# Altium schematic sheet Car_bord.SchDoc
size A3
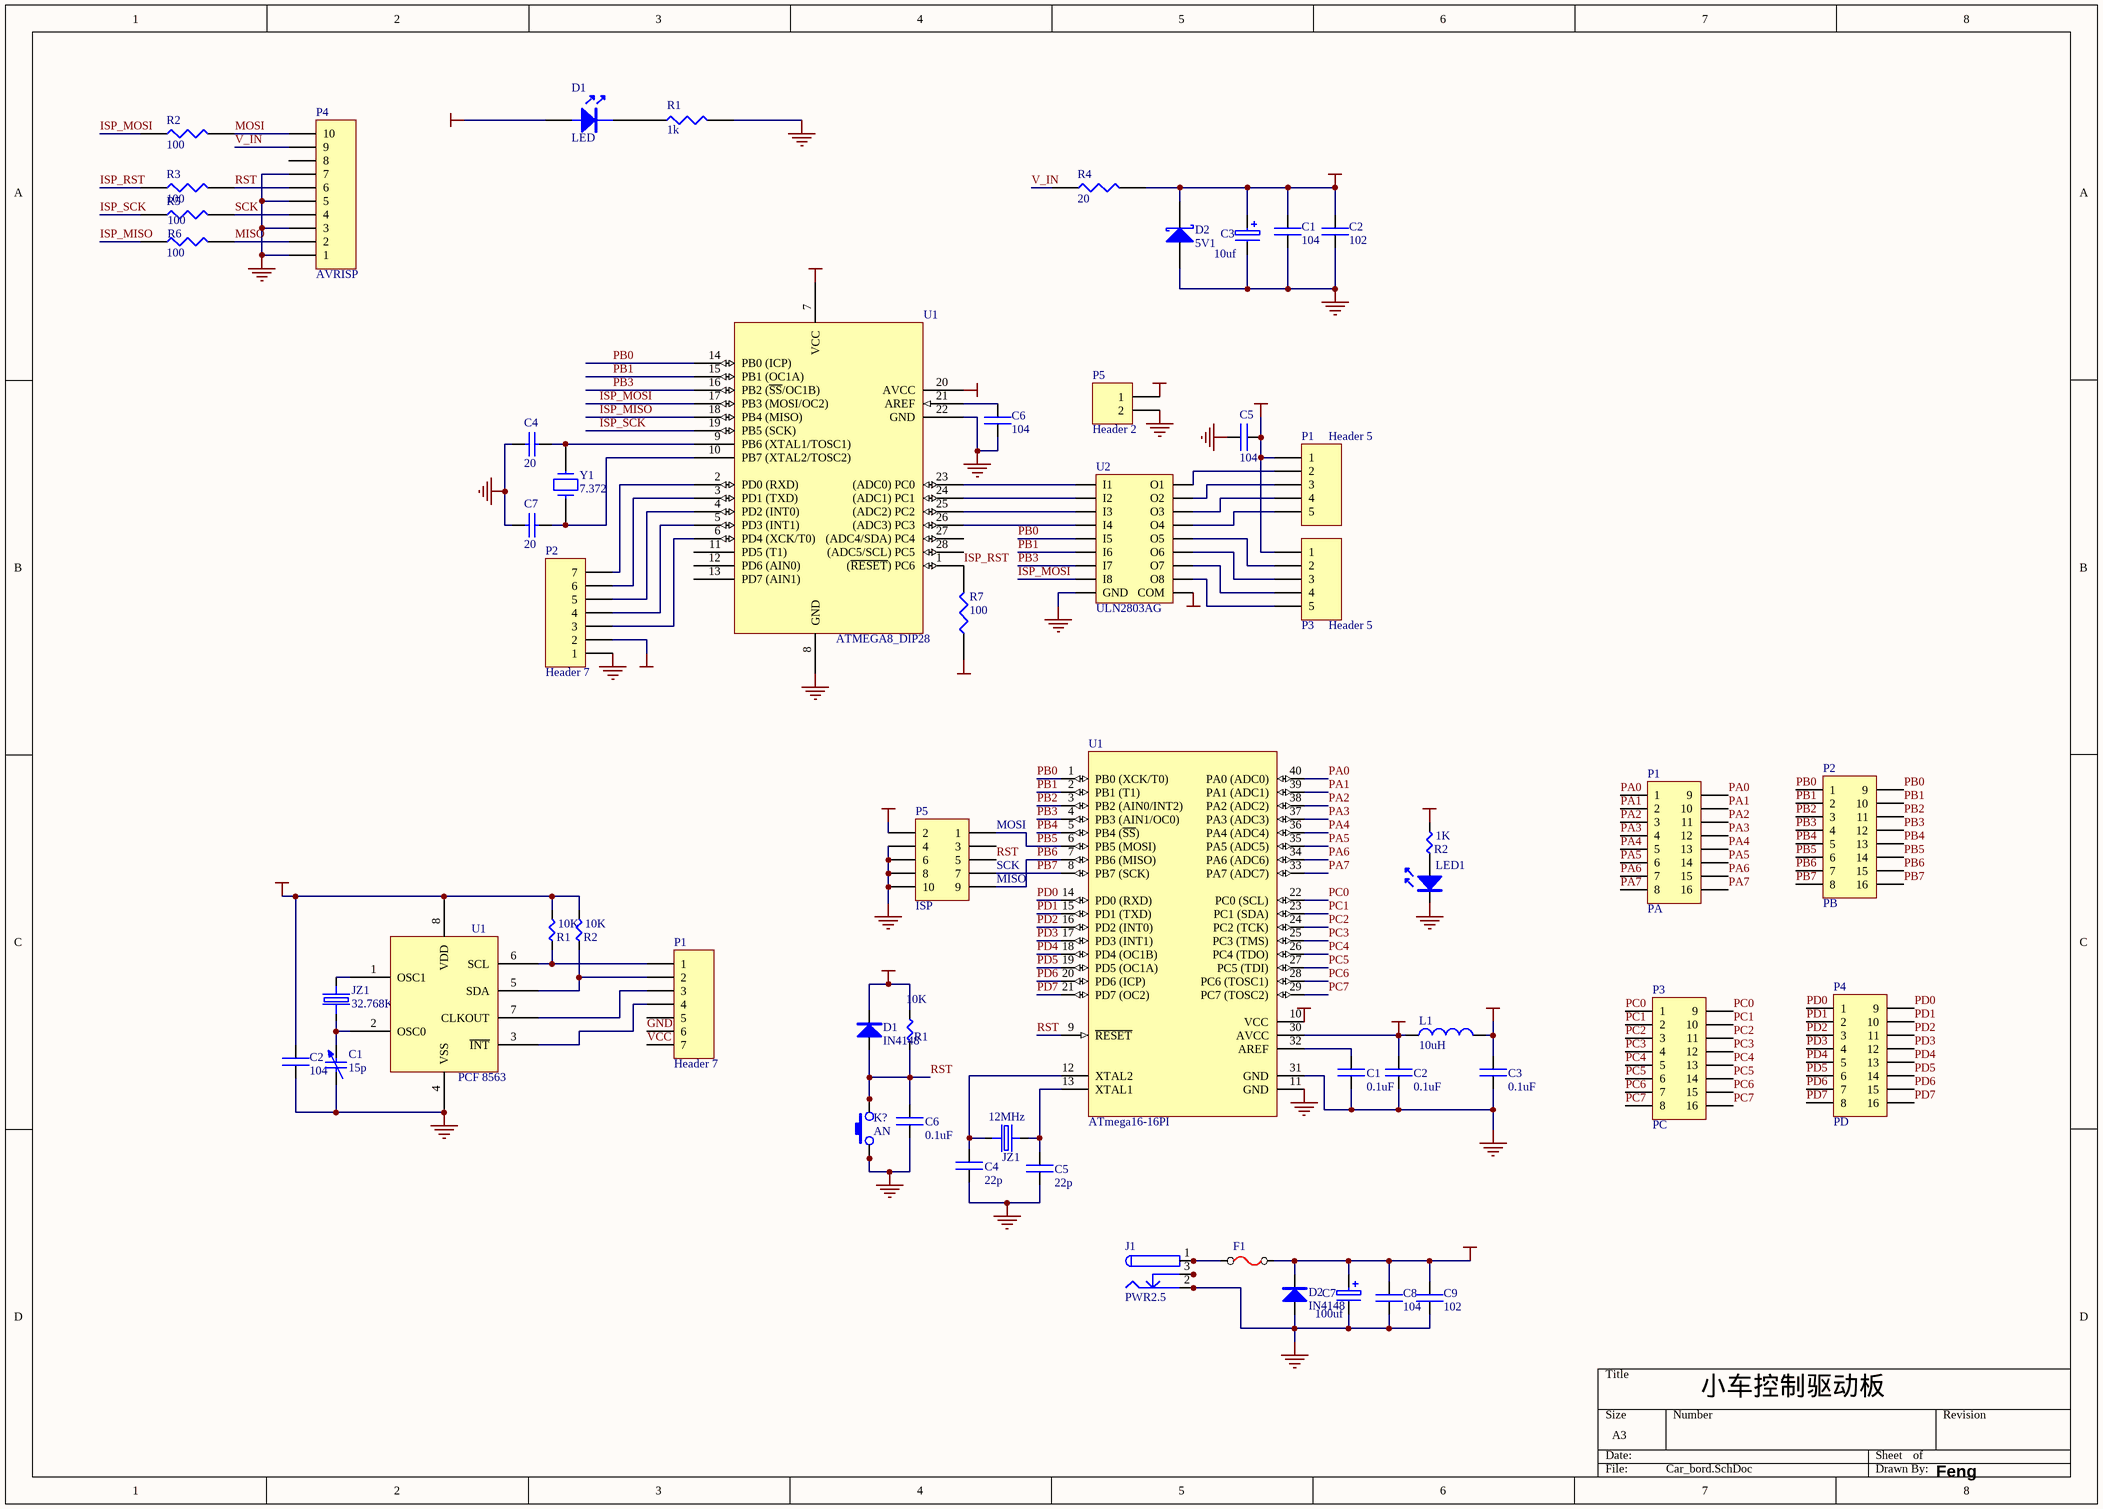
[diagram p0: Car_bord.SchDoc]

## Parts
(Parts that share a designator on the sheet are numbered #1, #2 ... from top to bottom, then left to right.)
C1#1  104  [CB1]
C1#2  0.1uF  [CAP_104]
C1#3  15p  [BCY-W2/D3.1]
C2#1  102  [CB1]
C2#2  104  [CAP_104]
C2#3  0.1uF  [CAP_104]
C3#1  10uf  [10U16]
C3#2  0.1uF  [CAP_104]
C4#1  20  [CB1]
C4#2  22p  [CB1]
C5#1  104  [CB1]
C5#2  22p  [CB1]
C6#1  104  [CB1]
C6#2  0.1uF  [CAP_104]
C7#1  20  [CB1]
C7#2  100uf  [10U16]
C8  104  [CAP_104]
C9  102  [CAP_104]
D1#1  LED  [LED_5]
D1#2  IN4148  [DIODE]
D2#1  5V1  [DIODE]
D2#2  IN4148  [DIODE]
F1  FUSE  [CAP_104]  (value not drawn)
J1  PWR2.5  [DC3]
JZ1#1  32.768K  [XTAL_S1]
JZ1#2  12MHz  [XTAL_US]
K?  AN  [SW-1212]
L1  10uH  [LD0.3]
LED1  *  [LED-3]  (value not drawn)
P1#1  Header 5  [HDR1X5]
P1#2  PA  [HDR2X8_CEN]
P1#3  Header 7  [HDR1X7]
P2#1  Header 7  [ISP]
P2#2  PB  [HDR2X8_CEN]
P3#1  Header 5  [HDR1X5]
P3#2  PC  [HDR2X8_CEN]
P4#1  AVRISP  [HDR2X5]
P4#2  PD  [HDR2X8_CEN]
P5#1  Header 2  [HDR1X2]
P5#2  ISP  [isp]
R1#1  1k  [AXIAL0.4]
R1#2  10K  [AXIAL0.4]
R1#3  10K  [AXIAL0.4]
R2#1  100  [AXIAL0.4]
R2#2  1K  [AXIAL0.4]
R2#3  10K  [AXIAL0.4]
R3  100  [AXIAL0.4]
R4  20  [AXIAL0.4]
R5  100  [AXIAL0.4]
R6  100  [AXIAL0.4]
R7  100  [AXIAL0.4]
U1#1  ATMEGA8_DIP28  [28P3]
U1#2  ATmega16-16PI  [40P6]
U1#3  PCF 8563  [DIP-8]
U2  ULN2803AG  [DIP18]
Y1  7.372  [XTAL_US]

## Nets
9V: C5#1.2 P1#1.1 P3#1.1 P5#1.1 U2.10(COM)
AVCC: C2#3.1 L1.1 U1#2.30(AVCC)
GND: C1#1.2 C1#2.2 C1#3.1 C2#1.2 C2#2.2 C2#3.2 C3#1.2 C3#2.2 C4#1.1 C4#2.2 C5#1.1 C5#2.2 C6#1.2 C6#2.2 C7#1.1 C7#2.2 C8.2 C9.2 D2#1.1(A) D2#2.1 J1.2 J1.2A J1.2B K?.1 K?.4 LED1.2 P1#3.6 P2#1.1 P4#1.1 P4#1.3 P4#1.5 P4#1.7 P5#1.2 P5#2.4 P5#2.6 P5#2.8 P5#2.10 R1#1.2 U1#1.8(GND) U1#1.22(GND) U1#2.11(GND) U1#2.31(GND) U1#3.4(VSS) U2.9(GND)
VCC: C1#1.1 C2#1.1 C2#2.1 C3#1.1 C3#2.1 C7#2.1 C8.1 C9.1 D1#1.1 D1#2.2 D2#1.2(K) D2#2.2 F1.2 L1.2 P1#3.7 P2#1.2 P5#2.2 R1#2.2 R1#3.2 R2#2.2 R2#3.2 R4.2 R7.1 U1#1.7(VCC) U1#1.20(AVCC) U1#2.10(VCC) U1#3.8(VDD)
ISP_MISO: R6.1 U1#1.18(PB4_(MISO))
ISP_MOSI: R2#1.1 U1#1.17(PB3_(MOSI/OC2)) U2.8(I8)
ISP_RST: R3.1 R7.2 U1#1.1((~{RESET})_PC6)
ISP_SCK: R5.1 U1#1.19(PB5_(SCK))
MISO: P4#1.2 R6.2
MOSI: P4#1.10 R2#1.2
PA0: P1#2.1 P1#2.9 U1#2.40(PA0_(ADC0))
PA1: P1#2.2 P1#2.10 U1#2.39(PA1_(ADC1))
PA2: P1#2.3 P1#2.11 U1#2.38(PA2_(ADC2))
PA3: P1#2.4 P1#2.12 U1#2.37(PA3_(ADC3))
PA4: P1#2.5 P1#2.13 U1#2.36(PA4_(ADC4))
PA5: P1#2.6 P1#2.14 U1#2.35(PA5_(ADC5))
PA6: P1#2.7 P1#2.15 U1#2.34(PA6_(ADC6))
PA7: P1#2.8 P1#2.16 U1#2.33(PA7_(ADC7))
PB0: P2#2.1 P2#2.9 U1#1.14(PB0_(ICP)) U1#2.1(PB0_(XCK/T0)) U2.5(I5)
PB1: P2#2.2 P2#2.10 U1#1.15(PB1_(OC1A)) U1#2.2(PB1_(T1)) U2.6(I6)
PB2: P2#2.3 P2#2.11 U1#2.3(PB2_(AIN0/INT2))
PB3: P2#2.4 P2#2.12 U1#1.16(PB2_(~{SS}/OC1B)) U1#2.4(PB3_(AIN1/OC0)) U2.7(I7)
PB4: P2#2.5 P2#2.13 U1#2.5(PB4_(~{SS}))
PB5: P2#2.6 P2#2.14 P5#2.1 U1#2.6(PB5_(MOSI))
PB6: P2#2.7 P2#2.15 P5#2.9 U1#2.7(PB6_(MISO))
PB7: P2#2.8 P2#2.16 P5#2.7 U1#2.8(PB7_(SCK))
PC0: P3#2.1 P3#2.9 U1#2.22(PC0_(SCL))
PC1: P3#2.2 P3#2.10 U1#2.23(PC1_(SDA))
PC2: P3#2.3 P3#2.11 U1#2.24(PC2_(TCK))
PC3: P3#2.4 P3#2.12 U1#2.25(PC3_(TMS))
PC4: P3#2.5 P3#2.13 U1#2.26(PC4_(TDO))
PC5: P3#2.6 P3#2.14 U1#2.27(PC5_(TDI))
PC6: P3#2.7 P3#2.15 U1#2.28(PC6_(TOSC1))
PC7: P3#2.8 P3#2.16 U1#2.29(PC7_(TOSC2))
PD0: P4#2.1 P4#2.9 U1#2.14(PD0_(RXD))
PD1: P4#2.2 P4#2.10 U1#2.15(PD1_(TXD))
PD2: P4#2.3 P4#2.11 U1#2.16(PD2_(INT0))
PD3: P4#2.4 P4#2.12 U1#2.17(PD3_(INT1))
PD4: P4#2.5 P4#2.13 U1#2.18(PD4_(OC1B))
PD5: P4#2.6 P4#2.14 U1#2.19(PD5_(OC1A))
PD6: P4#2.7 P4#2.15 U1#2.20(PD6_(ICP))
PD7: P4#2.8 P4#2.16 U1#2.21(PD7_(OC2))
RST: C6#2.1 D1#2.1 K?.2 K?.3 P4#1.6 P5#2.5 R1#3.1 R3.2 U1#2.9(~{RESET})
SCK: P4#1.4 R5.2
V_IN: P4#1.9 R4.1
NetC1#2_1: C1#2.1 U1#2.32(AREF)
NetC1#3_2: C1#3.2 JZ1#1.1 U1#3.2(OSC0)
NetC4#1_2: C4#1.2 U1#1.9(PB6_(XTAL1/TOSC1)) Y1.1
NetC4#2_1: C4#2.1 JZ1#2.1 U1#2.12(XTAL2)
NetC5#2_1: C5#2.1 JZ1#2.2 U1#2.13(XTAL1)
NetC6#1_1: C6#1.1 U1#1.21(AREF)
NetC7#1_2: C7#1.2 U1#1.10(PB7_(XTAL2/TOSC2)) Y1.2
NetD1#1_2: D1#1.2 R1#1.1
NetF1_1: F1.1 J1.1 J1.1A J1.1B
NetJ1_3: J1.3 J1.3A J1.3B
NetJZ1#1_2: JZ1#1.2 U1#3.1(OSC1)
NetLED1_1: LED1.1 R2#2.1
NetP1#1_2: P1#1.2 U2.18(O1)
NetP1#1_3: P1#1.3 U2.17(O2)
NetP1#1_4: P1#1.4 U2.16(O3)
NetP1#1_5: P1#1.5 U2.15(O4)
NetP1#3_1: P1#3.1 R1#2.1 U1#3.6(SCL)
NetP1#3_2: P1#3.2 R2#3.1 U1#3.5(SDA)
NetP1#3_3: P1#3.3 U1#3.7(CLKOUT)
NetP1#3_4: P1#3.4 U1#3.3(~{INT})
NetP2#1_3: P2#1.3 U1#1.6(PD4_(XCK/T0))
NetP2#1_4: P2#1.4 U1#1.5(PD3_(INT1))
NetP2#1_5: P2#1.5 U1#1.4(PD2_(INT0))
NetP2#1_6: P2#1.6 U1#1.3(PD1_(TXD))
NetP2#1_7: P2#1.7 U1#1.2(PD0_(RXD))
NetP3#1_2: P3#1.2 U2.14(O5)
NetP3#1_3: P3#1.3 U2.13(O6)
NetP3#1_4: P3#1.4 U2.12(O7)
NetP3#1_5: P3#1.5 U2.11(O8)
NetU1#1_23: U1#1.23((ADC0)_PC0) U2.1(I1)
NetU1#1_24: U1#1.24((ADC1)_PC1) U2.2(I2)
NetU1#1_25: U1#1.25((ADC2)_PC2) U2.3(I3)
NetU1#1_26: U1#1.26((ADC3)_PC3) U2.4(I4)

Not connected (* = marked no-connect by the designer): P1#3 5; P4#1 8; P5#2 3; U1#1 11(PD5_(T1)) 12(PD6_(AIN0)) 13(PD7_(AIN1)) 27((ADC4/SDA)_PC4) 28((ADC5/SCL)_PC5)

## Notes on the sheet
- (near P5#2) MOSI
- (near P5#2) SCK
- (near P5#2) MISO
- 小车控制驱动板
- Feng

## Library data of the parts
C1#1 C1#2 C2#1-C2#3 C3#2 C4#2 C5#1 C5#2 C6#1 C6#2 C8 C9 = E_4
C1#3 = Cap Var: Variable or Adjustable Capacitor; Value: 100pF; Published: 24-Mar-1999; LatestRevisionDate: 17-Jul-2002; LatestRevisionNote: Re-released for DXP Platform.; Publisher: Altium Limited
C3#1 C7#2 = E_2
C4#1 C7#1 = CAP: Capacitor
D2#1 = D Schottky: Schottky Diode; Published: 8-Jun-2000; LatestRevisionDate: 17-Jul-2002; LatestRevisionNote: Re-released for DXP Platform.; PackageReference: SMB; Publisher: Altium Limited; Code_JEDEC: DO-214-AA
J1 = PWR2.5: Low Voltage Power Supply Connector; Published: 17-Dec-2003; DatasheetDocument: 09-May-2002; Publisher: Altium Limited; ComponentLink1Description: Manufacturer Link; ComponentLink1URL: http://domino.kycon.com/internet/Products.html
JZ1#1 JZ1#2 = JZ
L1 = Inductor: Code_IEC: 1005; Published: 8-Jun-2000; LatestRevisionDate: 17-Jul-2002; LatestRevisionNote: Re-released for DXP Platform.; PackageReference: 0402-A; Publisher: Altium Limited; Code_JEITA: 0402
LED1 = LED_1
P1#1 P3#1 = Header 5: Header, 5-Pin; LatestRevisionDate: 17-Jul-2002; LatestRevisionNote: Re-released for DXP Platform.; Publisher: Altium Limited
P1#2 P2#2 P3#2 P4#2 = Header 8X2A: Header, 8-Pin, Dual row; LatestRevisionDate: 17-Jul-2002; LatestRevisionNote: Re-released for DXP Platform.; Publisher: Altium Limited
P1#3 P2#1 = Header 7: Header, 7-Pin; LatestRevisionDate: 17-Jul-2002; LatestRevisionNote: Re-released for DXP Platform.; Publisher: Altium Limited
P4#1 = CON10: Connector
P5#1 = Header 2: Header, 2-Pin; LatestRevisionDate: 17-Jul-2002; LatestRevisionNote: Re-released for DXP Platform.; Publisher: Altium Limited
P5#2 = Header 5X2: Header, 5-Pin, Dual row; LatestRevisionDate: 17-Jul-2002; LatestRevisionNote: Re-released for DXP Platform.; Publisher: Altium Limited
R1#1 R2#1 R3-R7 = RES1
R1#2 R1#3 R2#2 R2#3 = R1
U1#1 = ATMEGA8_DIP28: Atmel Microcontroller - Library created by carel..  <www.mpfreezone.com>
U1#2 = ATmega16-16PI: 8-Bit AVR Microcontroller with 16K Bytes of In-System Programmable Flash Memory; Published: 17-Sep-2003; LatestRevisionDate: 4-Mar-2005; LatestRevisionNote: Stylized 3D Model Added.; DatasheetDocument: 2466E-AVR-10/02; PackageDocument: Dec-1999; PackageReference: 40P6; Publisher: Altium Limited; ComponentLink1Description: Manufacturer Link; ComponentLink1URL: http://www.atmel.com; ComponentLink2Description: Datasheet; ComponentLink2URL: http://www.atmel.com/dyn/resources/prod_documents/doc2466.pdf
U1#3 = PCF 8563_1
U2 = TD62081
Y1 = CRYSTAL